# EAGLE design fbrf-fb-interface (EAGLE 4.16)
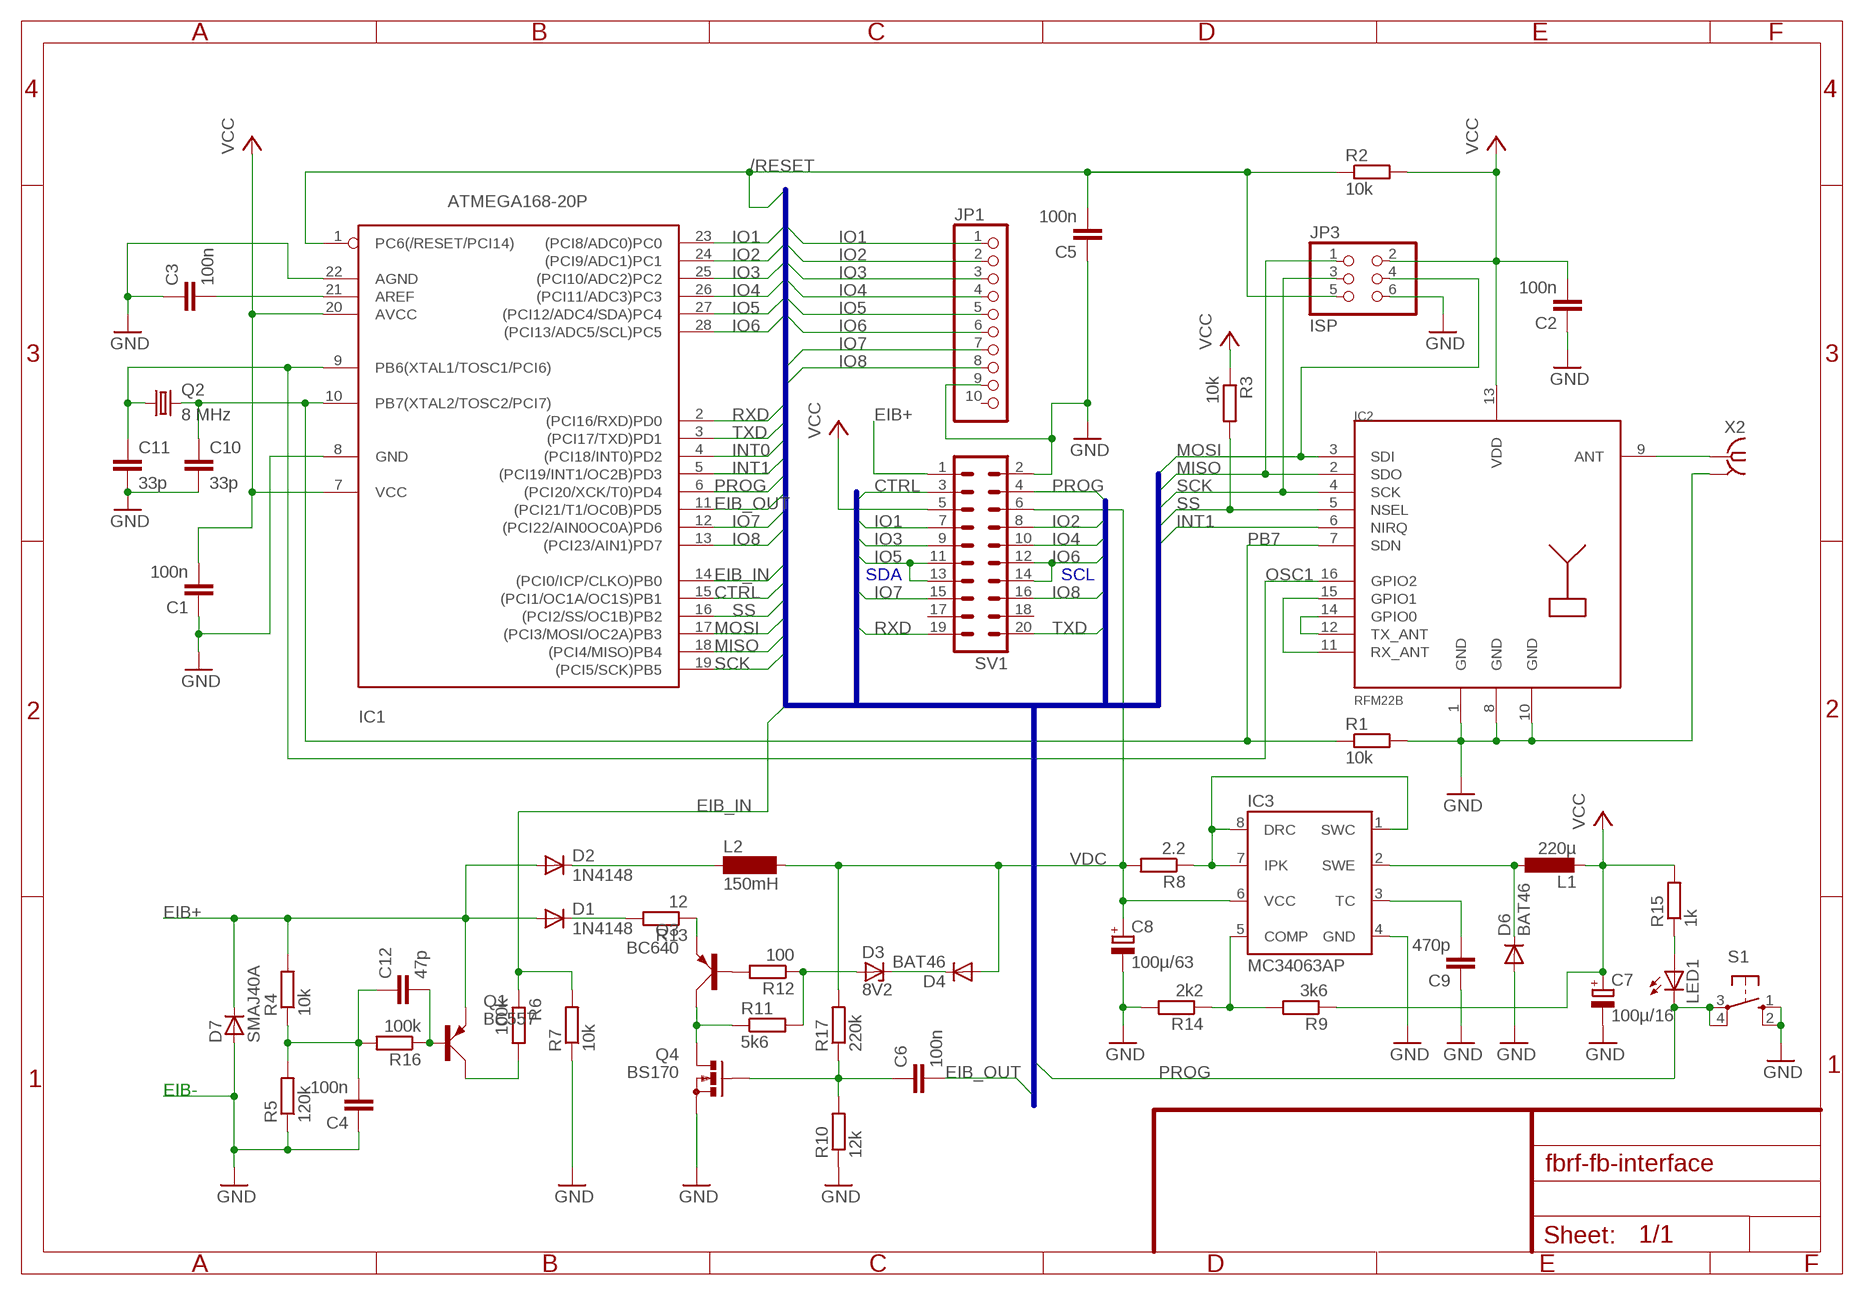
[diagram p0: schematic, sheet 1]

## Parts
C1  100n  C-EUC1206  [C1206]
C2  100n  C-EUC1206  [C1206]
C3  100n  C-EUC1206  [C1206]
C4  100n  C-EU050-024X044  [C050-024X044]
C5  100n  C-EU050-024X044  [C050-024X044]
C6  100n  C-EU050-024X044  [C050-024X044]
C7  100µ/16  CPOL-EUE2.5-7  [E2,5-7]
C8  100µ/63  CPOL-EUE5-10.5  [E5-10,5]
C9  470p  C-EU025-024X044  [C025-024X044]
C10  33p  C-EU025-024X044  [C025-024X044]
C11  33p  C-EU025-024X044  [C025-024X044]
C12  47p  C-EU025-024X044  [C025-024X044]
D1  1N4148  DIODE-DO35-10  [DO35-10]
D2  1N4148  DIODE-DO35-10  [DO35-10]
D3  8V2  ZENER-DIODEDO35Z10  [DO35Z10]
D4  BAT46  DIODE-DO35-10  [DO35-10]
D6  BAT46  DIODE-DO35-10  [DO35-10]
D7  SMAJ40A  D-SMB  [SMB]
IC1  ATMEGA168-20P  [DIL28-3]
IC2  RFM22B  [RFM2]
IC3  MC34063AP  [DIL-08]
JP1  PINHD-1X10  [1X10]
JP3  ISP  PINHD-2X3  [2X03]
L1  220µ  L-EU0207/12  [0207/12]
L2  150mH  SD12-1000  [SD12_1000]
LED1  LED3MM  [LED3MM]
Q1  BC557  [SOT54A]
Q2  8 MHz  CRYSTALHC49U-V  [HC49U-V]
Q3  BC640  [SOT54D]
Q4  BS170  [SOT54E]
R1  10k  R-EU_0207/10  [0207/10]
R2  10k  R-EU_0207/10  [0207/10]
R3  10k  R-EU_0207/10  [0207/10]
R4  10k  R-EU_0207/10  [0207/10]
R5  120k  R-EU_0207/10  [0207/10]
R6  100k  R-EU_0207/10  [0207/10]
R7  10k  R-EU_0207/10  [0207/10]
R8  2.2  R-EU_0207/10  [0207/10]
R9  3k6  R-EU_0207/10  [0207/10]
R10  12k  R-EU_0207/10  [0207/10]
R11  5k6  R-EU_0207/10  [0207/10]
R12  100  R-EU_0207/10  [0207/10]
R13  12  R-EU_0207/10  [0207/10]
R14  2k2  R-EU_0207/10  [0207/10]
R15  1k  R-EU_0207/10  [0207/10]
R16  100k  R-EU_0207/10  [0207/10]
R17  220k  R-EU_0207/10  [0207/10]
S1  10-XX  [B3F-10XX]
SV1  ML20  [ML20]
X2  BU-SMB-H  [BU-SMB-H]

## Nets
/RESET: C5.2 IC1.1(PC6(/RESET/PCI14)) JP3.5 R2.1
CTRL: IC1.15((PCI1/OC1A/OC1S)PB1) SV1.3
EIB+: D1.A D2.A D7.1(C) Q1.E R4.2 SV1.1
EIB_IN: IC1.14((PCI0/ICP/CLKO)PB0) R6.1 R7.2
EIB_OUT: C6.2 IC1.11((PCI21/T1/OC0B)PD5)
GND: C1.1 C2.1 C3.1 C4.1 C5.1 C7.- C8.- C9.1 C10.2 C11.2 D6.A D7.2(A) IC1.8(GND) IC1.22(AGND) IC2.1(GND) IC2.8(GND) IC2.10(GND) IC3.4(GND) JP1.9 JP3.6 Q4.S R1.2 R5.1 R7.1 R10.1 R14.2 S1.1(S) S1.2(S1) SV1.2 X2.2(GND)
INT0: IC1.4((PCI18/INT0)PD2)
INT1: IC1.5((PCI19/INT1/OC2B)PD3) IC2.6(NIRQ)
IO1: IC1.23((PCI8/ADC0)PC0) JP1.1 SV1.7
IO2: IC1.24((PCI9/ADC1)PC1) JP1.2 SV1.8
IO3: IC1.25((PCI10/ADC2)PC2) JP1.3 SV1.9
IO4: IC1.26((PCI11/ADC3)PC3) JP1.4 SV1.10
IO5: IC1.27((PCI12/ADC4/SDA)PC4) JP1.5 SV1.11 SV1.13
IO6: IC1.28((PCI13/ADC5/SCL)PC5) JP1.6 SV1.12 SV1.14
IO7: IC1.12((PCI22/AIN0OC0A)PD6) JP1.7 SV1.15
IO8: IC1.13((PCI23/AIN1)PD7) JP1.8 SV1.16
MISO: IC1.18((PCI4/MISO)PB4) IC2.2(SDO) JP3.1
MOSI: IC1.17((PCI3/MOSI/OC2A)PB3) IC2.3(SDI) JP3.4
N$1: IC2.12(TX_ANT) IC2.14(GPIO0)
N$2: IC2.9(ANT) X2.1
N$3: C3.2 IC1.21(AREF)
N$4: IC2.11(RX_ANT) IC2.15(GPIO1)
N$5: D1.C R13.2
N$6: Q1.C R6.2
N$7: D6.C IC3.2(SWE) L1.1
N$8: D2.C L2.1
N$9: IC3.1(SWC) IC3.7(IPK) IC3.8(DRC) R8.1
N$10: LED1.A R15.1
N$11: C12.2 Q1.B R16.1
N$12: C9.2 IC3.3(TC)
N$13: C4.2 C12.1 R4.1 R5.2 R16.2
N$14: IC3.5(COMP) R9.2 R14.1
N$22: Q3.C Q4.D R11.1
N$23: C6.1 Q4.G R10.2 R17.1
N$24: D3.C D4.C
N$25: D3.A R11.2 R12.1
N$26: Q3.E R13.1
N$27: Q3.B R12.2
OSC1: C11.1 IC1.9(PB6(XTAL1/TOSC1/PCI6)) IC2.16(GPIO2) Q2.1
PB7: C10.1 IC1.10(PB7(XTAL2/TOSC2/PCI7)) IC2.7(SDN) Q2.2 R1.1
PROG: IC1.6((PCI20/XCK/T0)PD4) LED1.K(C) S1.3(P) S1.4(P1) SV1.4
RXD: IC1.2((PCI16/RXD)PD0) SV1.19
SCK: IC1.19((PCI5/SCK)PB5) IC2.4(SCK) JP3.3
SS: IC1.16((PCI2/SS/OC1B)PB2) IC2.5(NSEL) R3.2
TXD: IC1.3((PCI17/TXD)PD1) SV1.20
VCC: C1.2 C2.2 C7.+ IC1.7(VCC) IC1.20(AVCC) IC2.13(VDD) JP3.2 L1.2 R2.2 R3.1 R9.1 R15.2 SV1.5
VDC: C8.+ D4.A IC3.6(VCC) L2.2 R8.2 R17.2 SV1.6
Unconnected: JP1.10 SV1.17 SV1.18

## Buses
PC[0..5],ADC6,ADC7,PD[0..7],PB[0..5],/RESET

## Notes on the sheet
- SDA | SCL
- EIB-

## Power pins joined to a net without a drawn wire
GND: X2.3(GND) X2.4(GND) X2.5(GND)

## Library data of the parts
C1-C6 C9-C12 = rcl:C-EU: CAPACITOR, European symbol
C7 C8 = rcl:CPOL-EU: POLARIZED CAPACITOR, European symbol
D1 D2 D4 D6 = diode:DIODE-: DIODE
D3 = diode:ZENER-DIODE: Z-Diode
D7 = semicon-smd-ipc:D-: DIODE unfilled
IC1 = avr:ATMEGA168*P: MICROCONTROLLER 16 kBytes FLASH 1 kBytes SRAM 512 Bytes EEPROM USART 8-channel 10 bit ADC
IC2 = RFMxx:RFM22B
IC3 = v-reg-3:MC34063A: 1.5A Step-Up/Down/Inverting Switching Regulator NPN Darlington Switch, Vin 3V to 40V, Current Limiter Input, adjustable Frequency up to 100kHz
JP1 = pinhead:PINHD-1X10: PIN HEADER
JP3 = pinhead:PINHD-2X3: PIN HEADER
L1 = rcl:L-EU: INDUCTOR, European symbol
L2 = inductor-neosid:SD12: INDUCTOR nominal inductance
LED1 = led:LED: LED OSRAM: - CHIPLED LG R971, LG N971, LY N971, LG Q971, LY Q971, LO R971, LY R971 LH N974, LH R974 LS Q976, LO Q976, LY Q976 LO Q996 - Hyper CHIPLED LW Q18S LB Q993, LB Q99A, LB R99A - SideLED LS A670, LO A670, LY A670, LG A670, LP A670 LB A673, LV A673, LT A673, LW A673 LH A674 LY A675 LS A676, LA A676, LO A676, LY A676, LW A676 LS A679, LY A679, LG A679 - Hyper Micro SIDELED® LS Y876, LA Y876, LO Y876, LY Y876 LT Y87S - SmartLED LW L88C, LW L88S LB L89C, LB L89S, LG L890 LS L89K, LO L89K, LY L89K LS L896, LA L896, LO L896, LY L896 - TOPLED LS T670, LO T670, LY T670, LG T670, LP T670 LSG T670, LSP T670, LSY T670, LOP T670, LYG T670 LG T671, LOG T671, LSG T671 LB T673, LV T673, LT T673, LW T673 LH T674 LS T676, LA T676, LO T676, LY T676, LB T676, LH T676, LSB T676, LW T676 LB T67C, LV T67C, LT T67C, LS T67K, LO T67K, LY T67K, LW E67C LS E67B, LA E67B, LO E67B, LY E67B, LB E67C, LV E67C, LT E67C LW T67C LS T679, LY T679, LG T679 LS T770, LO T770, LY T770, LG T770, LP T770 LB T773, LV T773, LT T773, LW T773 LH T774 LS E675, LA E675, LY E675, LS T675 LS T776, LA T776, LO T776, LY T776, LB T776 LHGB T686 LT T68C, LB T68C - Hyper Mini TOPLED® LB M676 - Mini TOPLED Santana® LG M470 LS M47K, LO M47K, LY M47K Source: http://www.osram.convergy.de - LUMILED® LXK2-PW12-R00, LXK2-PW12-S00, LXK2-PW14-U00, LXK2-PW14-V00 LXK2-PM12-R00, LXK2-PM12-S00, LXK2-PM14-U00 LXK2-PE12-Q00, LXK2-PE12-R00, LXK2-PE12-S00, LXK2-PE14-T00, LXK2-PE14-U00 LXK2-PB12-K00, LXK2-PB12-L00, LXK2-PB12-M00, LXK2-PB14-N00, LXK2-PB14-P00, LXK2-PB14-Q00 LXK2-PR12-L00, LXK2-PR12-M00, LXK2-PR14-Q00, LXK2-PR14-R00 LXK2-PD12-Q00, LXK2-PD12-R00, LXK2-PD12-S00 LXK2-PH12-R00, LXK2-PH12-S00 LXK2-PL12-P00, LXK2-PL12-Q00, LXK2-PL12-R00 Source: www.luxeon.com
Q1 = transistor-small-signal:BC557: PNP TRANSISTOR
Q2 = crystal:CRYSTAL: CRYSTAL
Q3 = transistor-small-signal:BC640: PNP TRANSISTOR
Q4 = transistor-small-signal:BS170: N-CHANNEL MOS FET
R1-R17 = rcl:R-EU_: RESISTOR, European symbol
S1 = switch-omron:10-XX: OMRON SWITCH
SV1 = con-ml:ML20: HARTING
X2 = con-coax:BU-SMB-H: FEMALE SMB CONNECTOR Radiall distributor RS 112-3003

## Board
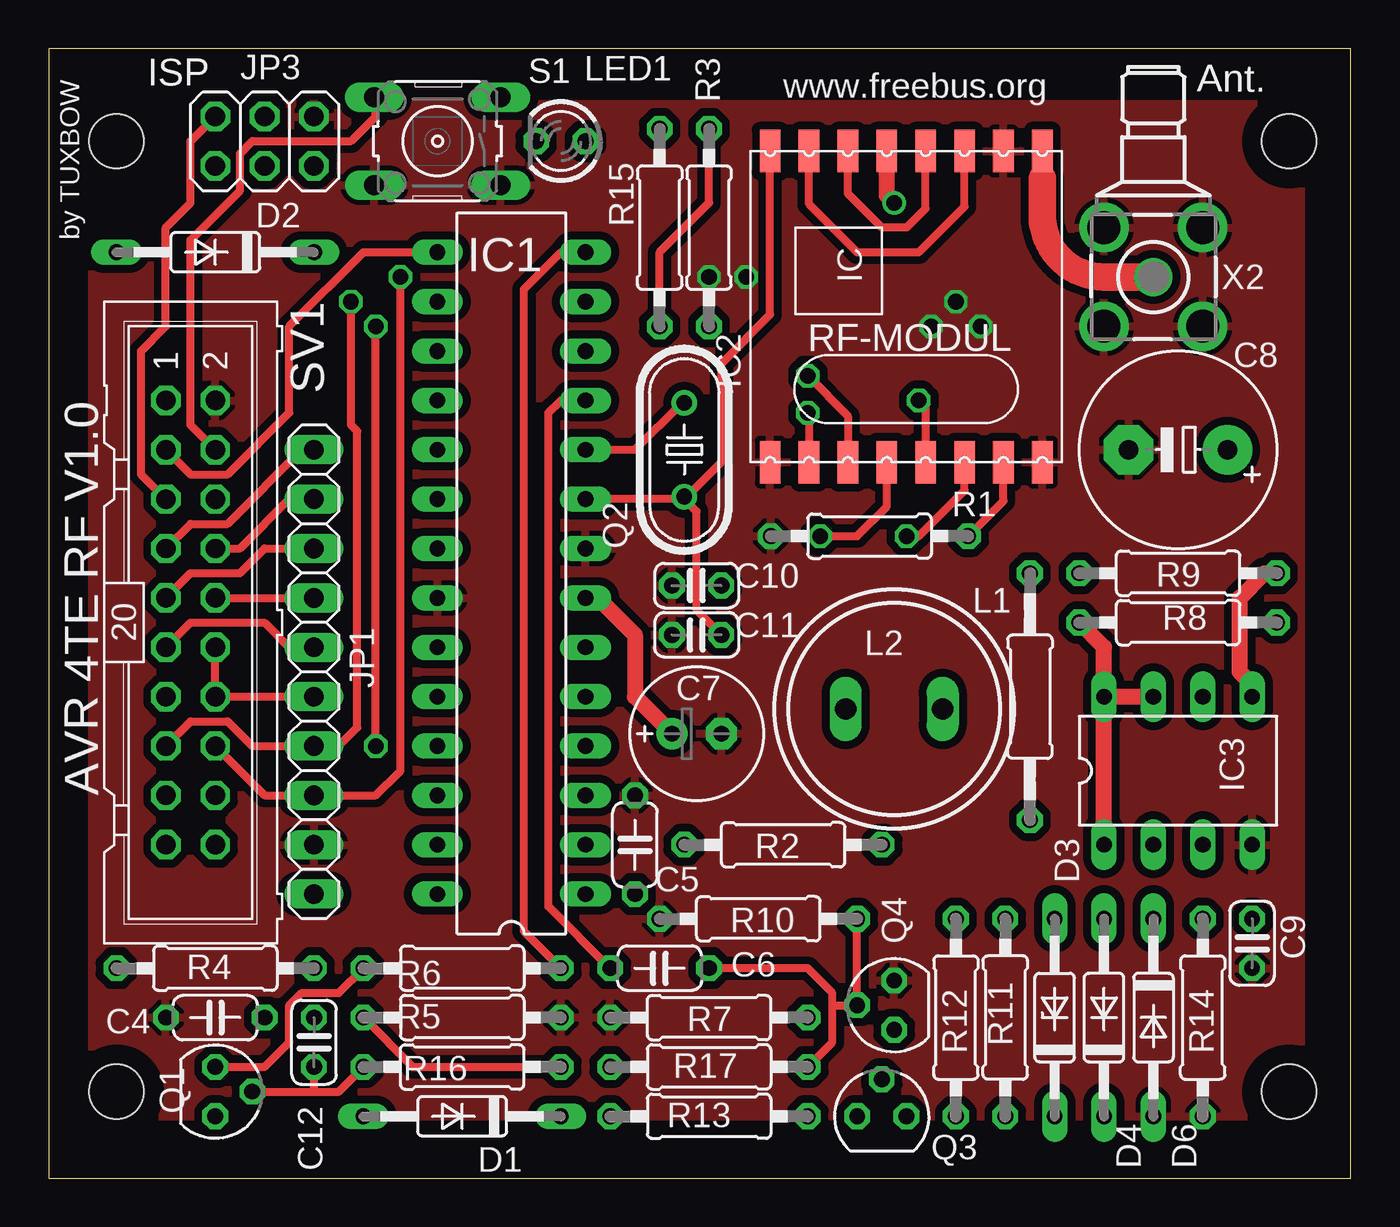
[diagram p1: board, top side]
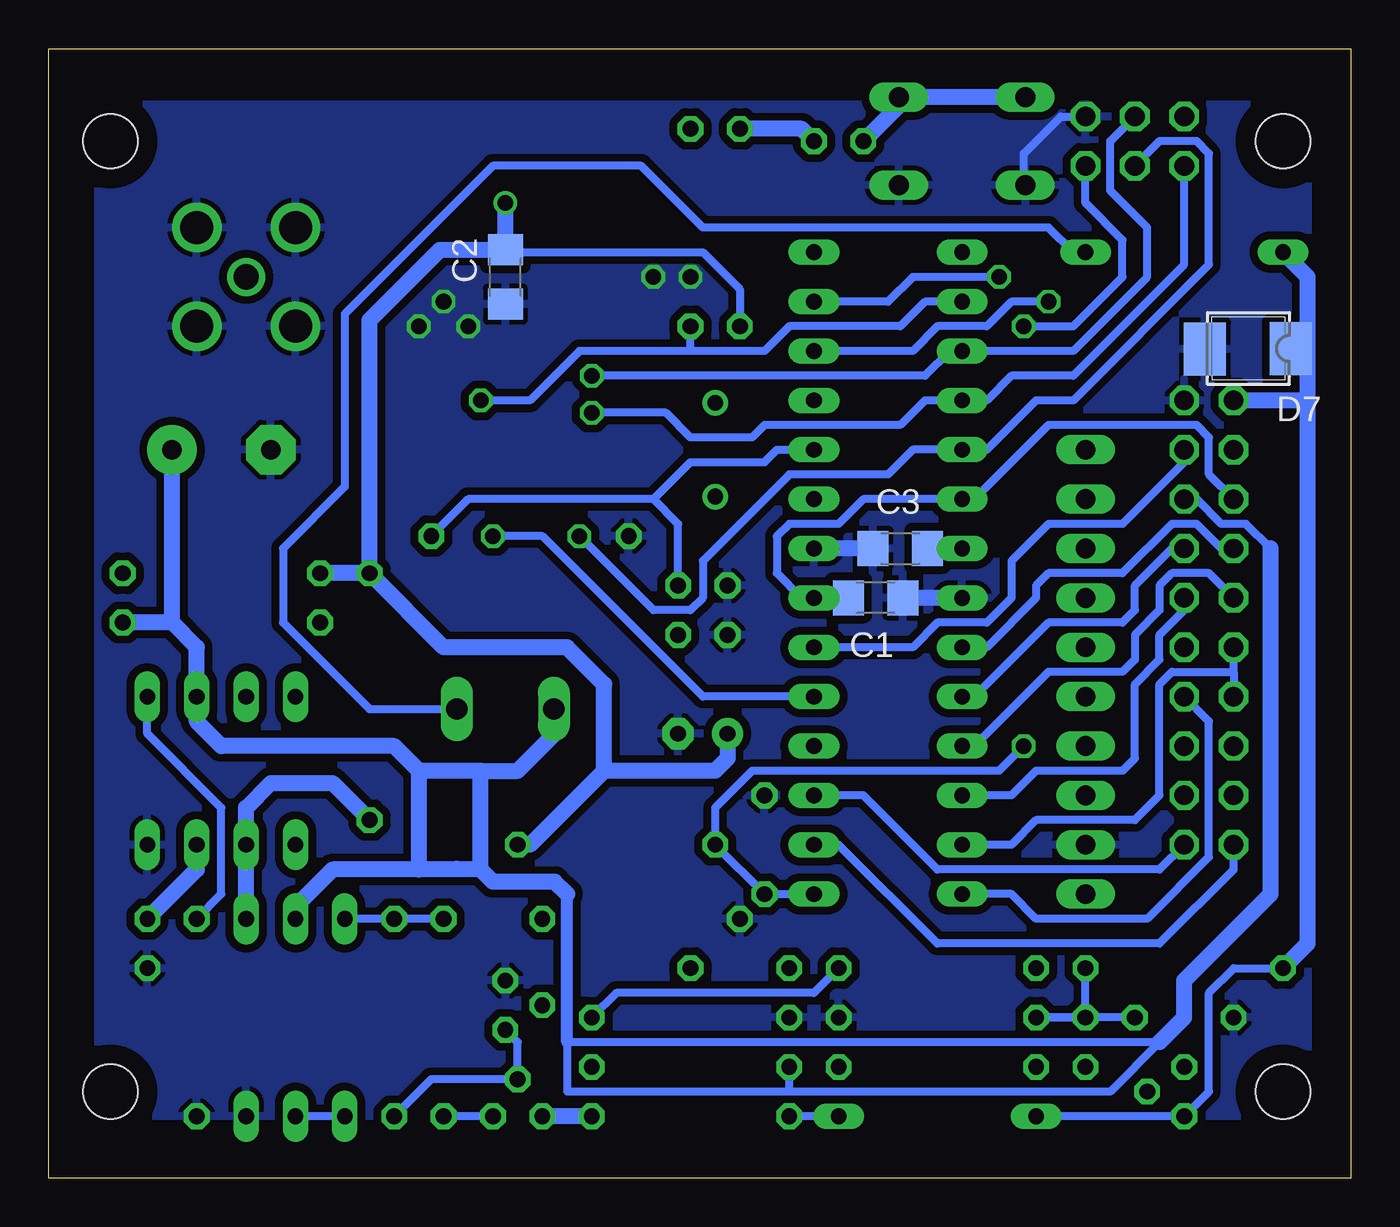
[diagram p2: board, bottom side, seen from below]

Size 66.99 x 58.1 mm. Coordinates in mm from the lower left corner, seen from the top.
Outline: 0,0 66.99,0 66.99,58.1 0,58.1 0,0
Copper layers (1*16): Top 0.035mm / dielectric 1.5mm / Bottom 0.035mm
Design rules "default": minimum track width 10mil, minimum drill 24mil, track to track 16mil, track to pad 12mil, pad to pad 16mil, via to via 16mil, smd to smd 16mil, copper to edge 40mil, drill to drill 8mil, minimum pad ring 10mil, minimum via ring 8mil, stop-mask expansion 4mil, vias tented up to drill 0mil, thermal gap 10mil
Holes 2.8 mm at 3.49,4.45 63.82,4.45 63.82,53.34 3.49,53.34

### Footprints (pad centres in the part's own frame; a part is rotated, then mirrored left to right if it is on the bottom)
C1206 = smd 1.6 x 1.8: 1 -1.4,0; 2 1.4,0
C050-024X044 = drill 0.813 octagon: 1 -2.54,0; 2 2.54,0
E2,5-7 = drill 0.813 pad 1.6 round: + -1.27,0 | drill 0.813 pad 1.6 octagon: - 1.27,0
E5-10,5 = drill 1.016 pad 2.54 round: + -2.54,0 | drill 1.016 pad 2.54 octagon: - 2.54,0
C025-024X044 = drill 0.813 octagon: 1 -1.27,0; 2 1.27,0
DO35-10 = drill 0.813 long: A 5.08,0; C -5.08,0
DO35Z10 = drill 0.813 long: A 5.08,0; C -5.08,0
SMB = smd 2.159 x 2.743: 1 -2.311,-0.127; 2 2.108,-0.102
DIL28-3 = drill 0.813 long: 1 -16.51,-3.81; 2 -13.97,-3.81; 3 -11.43,-3.81; 4 -8.89,-3.81; 5 -6.35,-3.81; 6 -3.81,-3.81; 7 -1.27,-3.81; 8 1.27,-3.81; 9 3.81,-3.81; 10 6.35,-3.81; 11 8.89,-3.81; 12 11.43,-3.81; 13 13.97,-3.81; 14 16.51,-3.81; 15 16.51,3.81; 16 13.97,3.81; 17 11.43,3.81; 18 8.89,3.81; 19 6.35,3.81; 20 3.81,3.81; 21 1.27,3.81; 22 -1.27,3.81; 23 -3.81,3.81; 24 -6.35,3.81; 25 -8.89,3.81; 26 -11.43,3.81; 27 -13.97,3.81; 28 -16.51,3.81
RFM2 = smd 2.184 x 1.067: 1 -7.62,6.38; 2 -7.62,4.38; 3 -7.62,2.38; 4 -7.62,0.38; 5 -7.62,-1.62; 6 -7.62,-3.62; 7 -7.62,-5.62; 8 -7.62,-7.62; 9 8.38,-7.62; 10 8.38,-5.62; 11 8.38,-3.62; 12 8.38,-1.62; 13 8.38,0.38; 14 8.38,2.38; 15 8.38,4.38; 16 8.38,6.38
DIL-08 = drill 0.813 long: 1 -3.81,-3.81; 2 -1.27,-3.81; 3 1.27,-3.81; 4 3.81,-3.81; 5 3.81,3.81; 6 1.27,3.81; 7 -1.27,3.81; 8 -3.81,3.81
1X10 = drill 1.016 long: 1 -11.43,0; 2 -8.89,0; 3 -6.35,0; 4 -3.81,0; 5 -1.27,0; 6 1.27,0; 7 3.81,0; 8 6.35,0; 9 8.89,0; 10 11.43,0
2X03 = drill 1.016 octagon: 1 -2.54,-1.27; 2 -2.54,1.27; 3 0,-1.27; 4 0,1.27; 5 2.54,-1.27; 6 2.54,1.27
0207/12 = drill 0.813 octagon: 1 -6.35,0; 2 6.35,0
SD12_1000 = drill 1.1 long: 1 -2.5,0; 2 2.5,0
LED3MM = drill 0.813 octagon: A -1.27,0; K 1.27,0
SOT54A = drill 0.813 octagon: B 0,1.905; C -1.27,0; E 1.27,0
HC49U-V = drill 0.813 round: 1 -2.413,0; 2 2.413,0
SOT54D = drill 0.813 octagon: B 1.27,0; C 0,1.905; E -1.27,0
SOT54E = drill 0.813 octagon: D -1.27,0; G 0,1.905; S 1.27,0
0207/10 = drill 0.813 octagon: 1 -5.08,0; 2 5.08,0
B3F-10XX = drill 1.016 long: 1 -3.251,2.261; 2 3.251,2.261; 3 -3.251,-2.261; 4 3.251,-2.261
ML20 = drill 1 octagon: 1 -11.43,-1.27; 2 -11.43,1.27; 3 -8.89,-1.27; 4 -8.89,1.27; 5 -6.35,-1.27; 6 -6.35,1.27; 7 -3.81,-1.27; 8 -3.81,1.27; 9 -1.27,-1.27; 10 -1.27,1.27; 11 1.27,-1.27; 12 1.27,1.27; 13 3.81,-1.27; 14 3.81,1.27; 15 6.35,-1.27; 16 6.35,1.27; 17 8.89,-1.27; 18 8.89,1.27; 19 11.43,-1.27; 20 11.43,1.27
BU-SMB-H = drill 1.3 round: 1 0,0 | drill 1.7 round: 2 -2.54,2.54; 3 2.54,2.54; 4 2.54,-2.54; 5 -2.54,-2.54

### Placement (x,y rotation side)
C1  24.45,29.84 180 bottom
C2  43.5,46.36 90 bottom
C3  23.18,32.39 0 bottom
C4  8.57,8.26 0 top
C5  30.16,17.14 270 top
C6  31.43,10.79 180 top
C7  33.34,22.86 0 top
C8  58.1,37.47 180 top
C9  61.91,12.06 90 top
C10  33.34,30.48 180 top
C11  33.34,27.94 180 top
C12  13.65,6.99 270 top
D1  21.27,3.17 180 top
D2  8.57,47.62 180 top
D3  51.75,8.26 90 top
D4  54.29,8.26 90 top
D6  56.83,8.26 270 top
D7  5.4,42.55 180 bottom
IC1  23.81,31.11 90 top
IC2  43.5,44.45 90 top
IC3  58.1,20.95 0 top
JP1  13.65,26.04 270 top
JP3  11.11,53.34 0 top
L1  50.48,24.76 90 top
L2  43.5,24.13 180 top
LED1  26.35,53.34 180 top
Q1  8.57,4.45 270 top
Q2  32.7,37.47 90 top
Q3  42.86,3.17 0 top
Q4  43.5,8.89 90 top
R1  42.23,33.02 180 top
R2  37.78,17.14 0 top
R3  33.97,48.9 270 top
R4  8.57,10.79 180 top
R5  21.27,8.26 180 top
R6  21.27,10.79 180 top
R7  33.97,8.26 0 top
R8  58.1,28.57 0 top
R9  58.1,31.11 0 top
R10  36.51,13.34 0 top
R11  49.21,8.26 90 top
R12  46.67,8.26 270 top
R13  33.97,3.17 180 top
R14  59.37,8.26 270 top
R15  31.43,48.9 270 top
R16  21.27,5.71 0 top
R17  33.97,5.71 180 top
S1  20,53.34 180 top
SV1  7.3,28.57 270 top
X2  56.83,46.36 90 top

### Tracks (layer width: path | path; a pad name or v marks a point on that pad's centre or on a via)
/RESET  (via drill 0.8)
  Top 0.406: v16.83,22.22 v16.83,43.82
  Bottom 0.406: JP3.5 13.65,50.16 11.75,48.26 11.75,46.36 14.29,43.82 v16.83,43.82 | v16.83,22.22 18.1,20.95 30.8,20.95 32.7,19.05 R2.1 C5.2 IC1.1
CTRL
  Top 0.406: SV1.3 7.3,36.2 9.21,36.2 12.38,39.37 12.38,43.82 16.19,47.62 IC1.15
EIB+
  Bottom 0.406: R4.2 6.03,10.79 7.3,9.53 7.3,4.45 Q1.E D1.A | D7.1 2.35,42.67 2.22,42.55
  Bottom 0.813: D2.A 2.22,46.36 2.22,42.55 2.22,40.01 | 2.22,40.01 2.22,12.06 R4.2 | 2.22,40.01 SV1.1
EIB_IN
  Top 0.406: IC1.14 26.35,47.62 24.45,45.72 24.45,12.7 R6.1
  Bottom 0.406: R7.2 37.78,9.53 27.62,9.53 R6.1
EIB_OUT
  Top 0.406: C6.2 25.72,13.97 25.72,39.37 26.35,40.01 IC1.11
GND  (via drill 0.8)
  Bottom 0.406: JP3.6 14.92,54.61 16.83,52.71 16.83,51.44 16.75,51.36 S1.2
  Bottom 0.813: 24.45,32.39 IC1.8 | IC1.22 23.18,29.84
  other vias: 45.4,43.82 46.67,45.09 47.94,43.82 33.97,46.36 35.88,46.36
  pour Bottom (isolate 0.406): 2.22,3.17 64.45,3.17 64.45,55.25 2.22,55.25
  pour Top (isolate 0.406): 2.22,3.17 64.45,3.17 64.45,55.25 2.22,55.25
INT1  (via drill 0.8)
  Top 0.406: v44.13,33.02 44.77,33.02 47.12,35.37 IC2.6
  Bottom 0.406: IC1.5 33.34,24.76 41.59,33.02 v44.13,33.02
IO1
  Top 0.406: JP1.1 13.02,37.47 9.21,33.66 7.3,33.66 SV1.7
  Bottom 0.406: SV1.7 6.67,32.39 7.94,33.66 9.21,33.66 11.75,31.11 15.56,31.11 16.19,30.48 16.19,29.84 18.73,27.3 IC1.23
IO2
  Top 0.406: JP1.2 12.38,34.93 9.84,32.39 SV1.8
  Bottom 0.406: IC1.24 19.37,24.76 15.56,28.57 11.75,28.57 11.11,29.21 11.11,30.48 9.21,32.39 SV1.8
IO3
  Top 0.406: JP1.3 11.11,32.39 9.84,31.11 7.3,31.11 SV1.9
  Bottom 0.406: IC1.25 19.37,22.22 15.56,26.04 11.75,26.04 11.11,26.67 11.11,27.94 9.84,29.21 9.84,30.48 9.21,31.11 7.3,31.11 SV1.9
IO4
  Top 0.406: SV1.10 JP1.4
  Bottom 0.406: 18.73,19.68 IC1.26 17.46,19.68 16.19,20.95 11.75,20.95 11.11,21.59 11.11,25.4 9.84,26.67 9.84,27.94 8.57,29.21 SV1.10
IO5
  Top 0.305: 12.38,27.3 JP1.5
  Top 0.406: 12.38,27.3 11.11,28.57 7.3,28.57 SV1.11
  Bottom 0.406: 6.03,26.04 SV1.13 | 6.03,26.04 SV1.11 | 6.03,26.04 9.21,26.04 9.84,25.4 9.84,19.68 11.11,18.41 16.19,18.41 17.46,17.14 IC1.27
IO6
  Top 0.406: JP1.6 SV1.14 SV1.12
  Bottom 0.406: IC1.28 17.46,14.61 16.19,13.34 10.48,13.34 7.3,16.51 7.3,23.49 SV1.14
IO7  (via drill 0.8)
  Top 0.406: SV1.15 7.3,23.49 9.21,23.49 10.48,22.22 JP1.7 14.92,22.22 15.87,23.18 15.87,38.42 15.56,38.73 v15.56,45.09
  Bottom 0.406: IC1.12 22.54,42.55 21.27,43.82 18.73,43.82 17.46,45.09 v15.56,45.09
IO8  (via drill 0.8)
  Top 0.406: SV1.16 11.11,19.68 JP1.8 16.83,19.68 18.1,20.95 v18.1,46.36
  Bottom 0.406: v18.1,46.36 22.54,46.36 23.81,45.09 IC1.13
MISO  (via drill 0.8)
  Top 0.406: IC2.2 39.12,39.3 v39.05,39.37
  Bottom 0.406: JP3.1 8.57,46.99 14.29,41.27 17.46,41.27 18.73,40.01 IC1.18 21.91,40.01 23.18,38.73 30.16,38.73 30.8,38.1 33.97,38.1 35.24,39.37 v39.05,39.37
MOSI  (via drill 0.8)
  Top 0.406: IC2.3 41.12,39.21 v39.05,41.27
  Bottom 0.406: JP3.4 12.38,53.34 12.38,50.8 10.48,48.9 10.48,46.36 14.29,42.55 IC1.17 20.64,42.55 21.91,41.27 v39.05,41.27
N$1
  Top 0.406: IC2.14 41.12,50.64 42.86,48.9 44.13,48.9 45.12,49.88 IC2.12
N$2
  Top 1.016: 51.12,51.44 IC2.9
  Top 1.422: X2.1 54.29,46.36 arc-90 51.12,49.53 51.12,51.44
N$3
  Bottom 0.813: IC1.21 C3.2
N$4
  Top 0.406: IC2.15 39.12,50.1 41.59,47.62 44.77,47.62 47.12,49.98 IC2.11
N$5
  Bottom 0.406: D1.C R13.2
N$6
  Top 0.406: Q1.C 11.11,5.71 12.38,6.99 12.38,8.89 13.02,9.53 14.92,9.53 R6.2
N$7
  Bottom 0.813: L1.1 52.39,20.32 55.56,20.32 56.83,19.05 IC3.2 D6.C
N$8
  Bottom 0.406: D2.C 14.29,47.62 15.56,48.9 33.34,48.9 36.51,52.07 44.13,52.07 51.75,44.45 51.75,35.56 54.93,32.39 54.93,28.57 50.48,24.13 L2.1
N$9
  Top 0.813: R8.1 54.29,27.3 IC3.8 | IC3.8 IC3.7 | IC3.1 IC3.8
N$10
  Bottom 0.813: R15.1 28.26,53.98 LED1.A
N$11
  Top 0.406: R16.1 14.92,4.45 13.65,4.45 | Q1.B 13.65,4.45 | 13.65,4.45 C12.2
N$12
  Bottom 0.813: C9.2 59.37,15.88 IC3.3
N$13
  Top 0.406: R5.2 18.73,5.71 R16.2
  Bottom 0.406: C4.2 R5.2 C12.1 R4.1
N$14
  Top 0.813: R9.2 62.55,31.11 61.28,29.84 61.28,26.04 61.91,25.4 IC3.5
  Bottom 0.406: R14.1 58.1,14.61 58.1,19.05 61.91,22.86 IC3.5
N$22
  Bottom 0.406: R11.1 47.31,5.08 Q3.C 42.86,6.99 Q4.D
N$23
  Top 0.406: C6.1 39.05,10.79 40.32,9.53 40.32,8.89 | 40.32,8.89 40.32,6.99 R17.1 | 40.32,8.89 Q4.G R10.2
N$24
  Bottom 0.406: D3.C D4.C
N$25
  Bottom 0.406: R12.1 R11.2 D3.A
N$26
  Bottom 0.813: R13.1 Q3.E
N$27
  Bottom 0.406: Q3.B R12.2
OSC1
  Top 0.406: 32.7,34.93 33.34,34.29 33.34,29.21 C11.1 | 32.7,34.93 IC1.9 | IC2.16 37.12,44.42 34.61,41.91 34.61,36.83 32.7,34.93 | 32.7,34.93 Q2.1
PB7
  Top 0.406: Q2.2 32.58,39.88 30.16,37.47 IC1.10 | 49.21,36.83 IC2.7 49.12,34.83 R1.1
  Bottom 0.406: R1.1 45.4,34.93 35.88,34.93 | 35.88,34.93 34.61,33.66 C10.1 | IC1.10 29.53,37.47 30.16,36.83 33.97,36.83 35.88,34.93
PROG
  Top 0.406: S1.4 16.83,55.6 16.83,54.61 15.56,53.34 10.48,53.34 9.84,52.71 9.84,50.8 7.3,48.26 7.3,38.73 SV1.4
  Bottom 0.406: SV1.4 8.57,36.83 11.75,33.66 15.56,33.66 17.46,31.75 17.46,29.84 18.73,28.57 21.27,28.57 22.54,27.3 IC1.6
  Bottom 0.813: S1.4 22.82,55.6 23.18,55.25 23.25,55.32 S1.3 23.25,55.17 LED1.K
RXD
  Bottom 0.406: SV1.19 6.03,15.88 9.84,12.06 21.27,12.06 26.35,17.14 IC1.2
SCK  (via drill 0.8)
  Top 0.406: v39.69,33.02 41.59,33.02 43.12,34.55 IC2.4
  Bottom 0.406: JP3.3 9.84,53.34 7.94,53.34 7.3,52.71 7.3,46.99 14.29,40.01 16.19,40.01 18.73,37.47 IC1.19 22.54,37.47 23.81,36.2 28.89,36.2 33.34,31.75 33.34,29.84 33.97,29.21 35.88,29.21 v39.69,33.02
SS  (via drill 0.8)
  Top 0.406: IC2.5 45.12,39.66 v44.77,40.01
  Bottom 0.406: IC1.16 21.91,45.09 23.18,43.82 28.89,43.82 30.16,42.55 33.97,42.55 | 33.97,42.55 39.69,42.55 42.23,40.01 v44.77,40.01 | 33.97,42.55 R3.2
TXD
  Bottom 0.406: SV1.20 9.84,15.88 21.27,15.88 25.08,19.68 IC1.3
VCC  (via drill 0.8)
  Top 0.406: JP3.2 7.3,53.34 7.3,50.16 6.03,48.9 6.03,43.82 4.76,42.55 4.76,36.2 SV1.5 | R3.1 33.97,50.16 31.43,47.62 R15.2
  Top 0.813: IC1.7 28.26,29.84 30.16,27.94 30.16,24.76 C7.+ | IC2.13 43.12,50.55 v43.5,50.16
  Bottom 0.406: SV1.5 7.3,36.2 7.3,38.1 7.94,38.73 15.56,38.73 19.37,34.93 IC1.20 25.08,34.93 26.35,33.66 28.89,33.66 29.53,33.02 29.53,31.11 28.26,29.84 IC1.7 | C2.2 43.5,47.62 33.34,47.62 31.43,45.72 R15.2
  Bottom 0.813: IC1.7 C1.2 | v43.5,50.16 C2.2 46.86,47.76 50.48,44.13 L1.2 | C7.+ 32.07,21.59 32.7,20.95 38.42,20.95 | L1.2 R9.1 | L1.2 46.67,27.3 40.32,27.3 38.42,25.4 38.42,20.95 | R2.2 42.23,17.14 38.42,20.95
VDC
  Bottom 0.406: SV1.6 7.94,34.93 6.67,33.66 5.4,33.66 4.13,32.39 | 28.89,4.45 12.38,4.45 9.84,6.99 40.32,6.99 40.32,4.45 28.89,4.45 | 28.89,4.45 R17.2
  Bottom 0.61: 40.32,6.99 40.32,14.61
  Bottom 0.813: 60.64,28.57 R8.2 | 4.13,32.39 4.13,14.61 8.57,10.16 8.57,8.26 9.84,6.99 | 44.77,15.88 44.13,15.24 40.96,15.24 40.32,14.61 | 44.77,15.88 46,15.92 | 44.77,15.88 47.94,15.88 | 47.94,15.88 52.39,15.88 54.29,13.97 D4.A | 60.64,28.57 59.37,27.3 IC3.6 59.37,23.49 58.1,22.22 49.21,22.22 47.94,20.95 | 60.64,28.57 C8.+ | 47.94,15.88 47.94,20.95 | L2.2 41,22.82 42.86,20.95 44.77,20.95 | 44.77,20.95 47.94,20.95 | 44.77,15.88 44.77,20.95

### Text on the board
tNames: ISP | Ant. | www.freebus.org | by TUXBOW | RF-MODUL | AVR 4TE RF V1.0